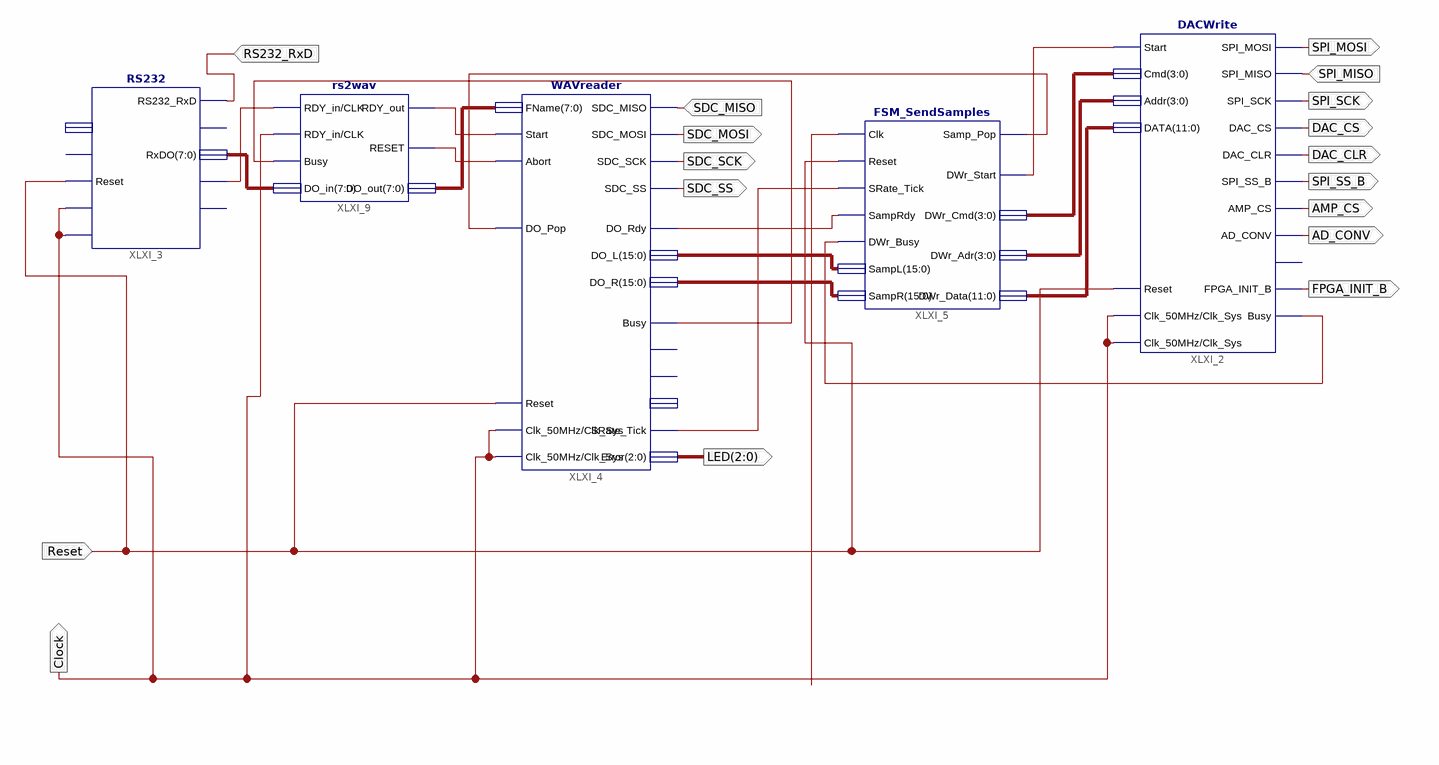
[diagram p0: schematic sheet 1]
// Xilinx ISE schematic main.sch (spartan3e) as structural Verilog: 5 symbols, 17 ports
module main (
  input  SPI_MISO,
  input  SDC_MISO,
  input  Reset,
  input  RS232_RxD,
  output SPI_MOSI,
  output SPI_SCK,
  output DAC_CS,
  output DAC_CLR,
  output SPI_SS_B,
  output AMP_CS,
  output AD_CONV,
  output FPGA_INIT_B,
  output SDC_MOSI,
  output SDC_SCK,
  output SDC_SS,
  output Clock,
  output [2:0] LED
);

  wire XLXN_15, XLXN_38, XLXN_46, XLXN_49, XLXN_50, XLXN_54, XLXN_71, XLXN_72, XLXN_77;
  wire [3:0] XLXN_16, XLXN_17;
  wire [7:0] XLXN_68, XLXN_70;
  wire [11:0] XLXN_18;
  wire [15:0] XLXN_39, XLXN_40;

  DACWrite XLXI_2 (
    .Reset(Reset), .Start(XLXN_15), .SPI_MISO(SPI_MISO), .Cmd(XLXN_16), .Addr(XLXN_17), .DATA(XLXN_18),
    .DAC_CLR(DAC_CLR), .DAC_CS(DAC_CS), .SPI_MOSI(SPI_MOSI), .SPI_SCK(SPI_SCK), .SPI_SS_B(SPI_SS_B),
    .AMP_CS(AMP_CS), .AD_CONV(AD_CONV), .FPGA_INIT_B(FPGA_INIT_B), .Busy(XLXN_49), .Clk_50MHz(Clock),
    .Clk_Sys(Clock));  // open: SF_CE0
  RS232 XLXI_3 (
    .Clk_50MHz(Clock), .Reset(Reset), .RS232_RxD(RS232_RxD), .RxRdy(Clock), .RxDO(XLXN_68), .Clk_Sys(Clock));  // open: TxStart, TxDI, TxBusy, RS232_TxD
  WAVreader XLXI_4 (
    .FName(XLXN_70), .Start(XLXN_72), .Abort(XLXN_71), .SDC_MOSI(SDC_MOSI), .SDC_SCK(SDC_SCK),
    .SDC_SS(SDC_SS), .SDC_MISO(SDC_MISO), .DO_Pop(XLXN_54), .SRate_Tick(XLXN_50), .Error(LED), .Reset(Reset),
    .Clk_50MHz(Clock), .Clk_Sys(Clock), .DO_Rdy(XLXN_38), .DO_L(XLXN_39), .DO_R(XLXN_40), .Busy(XLXN_77));  // open: FmtMnS, Fmt8n16, FmtSRate
  FSM_SendSamples XLXI_5 (
    .Clk(XLXN_46), .Reset(Reset), .SRate_Tick(XLXN_50), .SampRdy(XLXN_38), .DWr_Busy(XLXN_49),
    .SampL(XLXN_39), .SampR(XLXN_40), .Samp_Pop(XLXN_54), .DWr_Start(XLXN_15), .DWr_Cmd(XLXN_16),
    .DWr_Adr(XLXN_17), .DWr_Data(XLXN_18));
  rs2wav XLXI_9 (
    .RDY_in(Clock), .CLK(Clock), .Busy(XLXN_77), .DO_in(XLXN_68), .RDY_out(XLXN_72), .RESET(XLXN_71),
    .DO_out(XLXN_70));
endmodule
